# Altium schematic sheet H-00488 - Connectors Upstream.SchDoc: Connectors Upstream
size 403 x 281 mm; DocumentNumber: 11; SheetNumber: 11; SheetTotal: 12
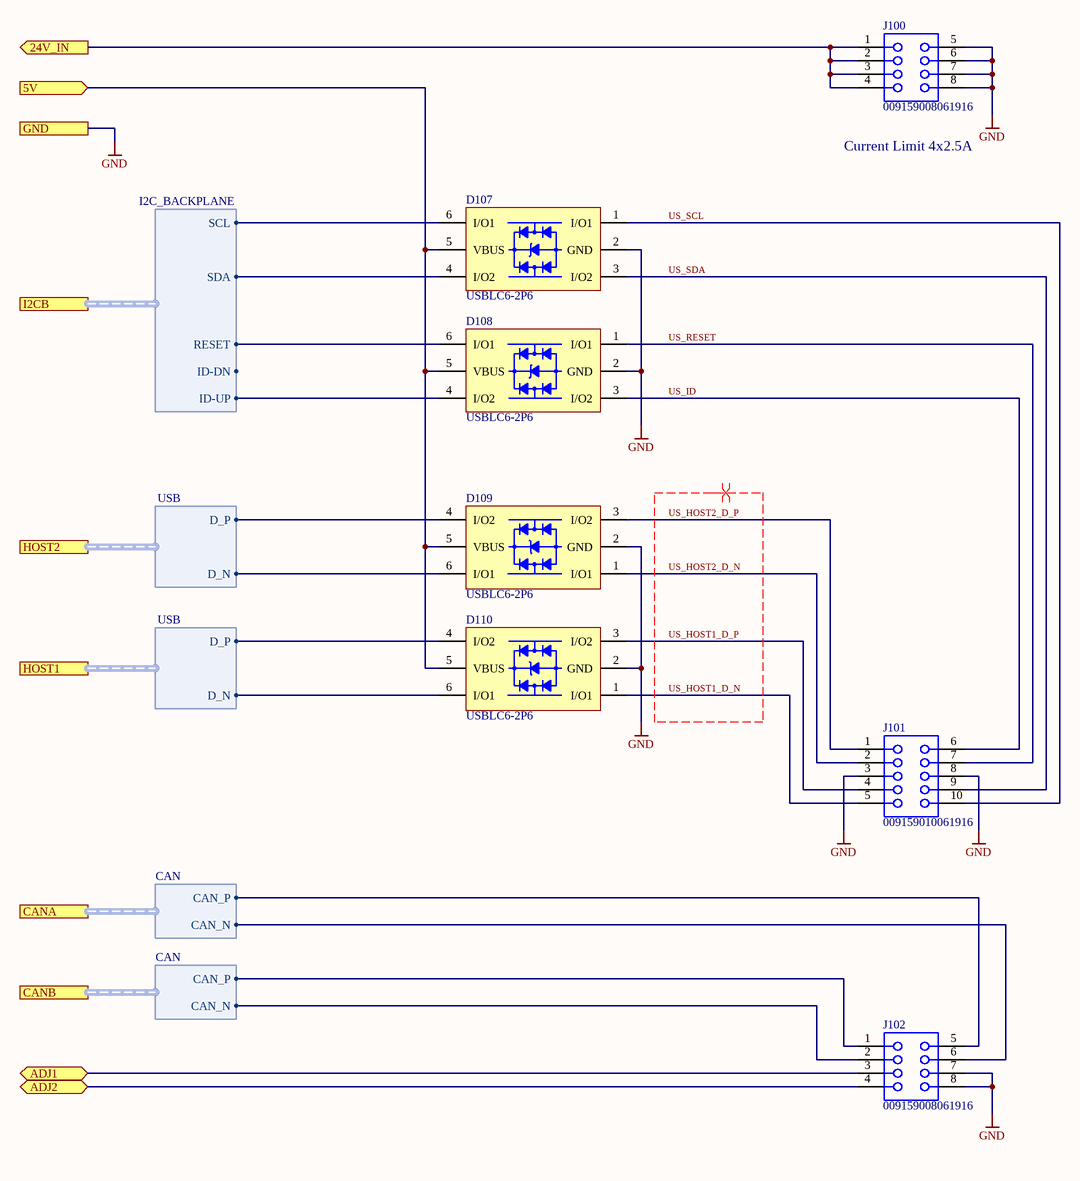
[diagram p0: H-00488 - Connectors Upstream.SchDoc]

## Parts
D107  USBLC6-2P6  [DIOSOFL6P50_160X160X95L29X26]
D108  USBLC6-2P6  [DIOSOFL6P50_160X160X95L29X26]
D109  USBLC6-2P6  [DIOSOFL6P50_160X160X95L29X26]
D110  USBLC6-2P6  [DIOSOFL6P50_160X160X95L29X26]
J100  009159008061916  [AVX_00-9159-008]
J101  009159010061916  [AVX_00-9159-010]
J102  009159008061916  [AVX_00-9159-008]

## Ports
5V (in), 24V_IN (out), ADJ1 (bidir), ADJ2 (bidir), CANA (harness CAN), CANB (harness CAN), GND, HOST1 (harness USB), HOST2 (harness USB), I2CB (harness I2C_BACKPLANE)

## Harnesses
I2C_BACKPLANE: SDA, SCL, ID-UP, RESET, ID-DN
USB: D_P, D_N
CAN: CAN_N, CAN_P

## Nets
GND: D107.2(GND) D108.2(GND) D109.2(GND) D110.2(GND) J100.5 J100.6 J100.7 J100.8 J101.3 J101.8 J102.7 J102.8 ; port GND
5V: D107.5(VBUS) D108.5(VBUS) D109.5(VBUS) D110.5(VBUS) ; port 5V
24V_IN: J100.1 J100.2 J100.3 J100.4 ; port 24V_IN
ADJ1: J102.3 ; port ADJ1
ADJ2: J102.4 ; port ADJ2
US_HOST1_D_N: D110.1(I/O1) J101.5
US_HOST1_D_P: D110.3(I/O2) J101.4
US_HOST2_D_N: D109.1(I/O1) J101.2
US_HOST2_D_P: D109.3(I/O2) J101.1
US_ID: D108.3(I/O2) J101.6
US_RESET: D108.1(I/O1) J101.7
US_SCL: D107.1(I/O1) J101.10
US_SDA: D107.3(I/O2) J101.9
NetD107_4: D107.4(I/O2) ; port I2CB.SDA
NetD107_6: D107.6(I/O1) ; port I2CB.SCL
NetD108_4: D108.4(I/O2) ; port I2CB.ID-UP
NetD108_6: D108.6(I/O1) ; port I2CB.RESET
NetD109_4: D109.4(I/O2) ; port HOST2.D_P
NetD109_6: D109.6(I/O1) ; port HOST2.D_N
NetD110_4: D110.4(I/O2) ; port HOST1.D_P
NetD110_6: D110.6(I/O1) ; port HOST1.D_N
NetJ102_1: J102.1 ; port CANB.CAN_P
NetJ102_2: J102.2 ; port CANB.CAN_N
NetJ102_5: J102.5 ; port CANA.CAN_P
NetJ102_6: J102.6 ; port CANA.CAN_N

## Layout directives
differential pair; differential pair class DIFF_USB_EXT: US_HOST1_D_N, US_HOST1_D_P, US_HOST2_D_N, US_HOST2_D_P

## Notes on the sheet
- (near J100) Current Limit 4x2.5A
- PROJECT
- DESCRIPTION
- SIZE
- ENGINEER
- VARIANT
- A3
- TITLE
- MODIFIED
- RELEASE
- HIBER BV
  MOERMANSKKADE 600
  1013 BC, AMSTERDAM
  THE NETHERLANDS
- FILE NAME
- APPROVER
- SHEET
- APPROVED
- OF
- THIS DOCUMENT AND THE DATA DISCLOSED HEREIN OR HEREWITH IS THE PROPERTY OF HIBER INTERNATIONAL BV. IT CONTAINS CONFIDENTIAL AND PROPRIETARY INFORMATION THAT CANNOT BE REPRODUCED OR DIVULGED, IN WHOLE OR IN PART, WITHOUT WRITTEN AUTHORIZATION.

## Library data of the parts
D107-D110 = CMP-00780-2: TVS DIODE 5.25VWM 17VC SOT666; Reverse Breakdown Voltage: 6V; ESD Protection: Yes; Max Reverse Leakage Current: 150nA; Number of Elements: 1; Clamping Voltage: 17V; Direction: Bidirectional, Unidirectional; Capacitance: 3.5pF; Working Voltage: 5V; Number of Channels: 2; Test Current: 1mA; Peak Pulse Current: 5A; Element Configuration: Dual; Qualification: Standard; Max Operating Temperature: 125°C; Lead Free: Lead Free; Contact Plating: Matte, Tin; Package Quantity: 1; Case/Package: SOT-666; Min Operating Temperature: -40°C; Length: 1.7mm; Breakdown Voltage: 6V; Packaging: Tape and Reel; REACH SVHC: No SVHC; Termination: SMD/SMT; Mount: Surface Mount; Power Line Protection: Yes; Radiation Hardening: No; RoHS: Yes; Leakage Current: 150nA; Polarity: Bidirectional, Unidirectional; Depth: 1.3mm; Number of Bidirectional Channels: 2; Number of Pins: 6; Height: 0.6mm; Reverse Standoff Voltage: 5V; Width: 1.3mm; Min Breakdown Voltage: 6V; Operating Supply Voltage: 5V; Max Breakdown Voltage: 6V
J100 J102 = CMP-01083-5: CONN SSL BRIDGE 8POS 2MM; RoHS: Yes; Mount: TH
J101 = CMP-01075-4: AVX INTERCONNECT - 009159010061916 - CARD EDGE CONN, DUAL SIDE, 10POS, SMD; RoHS: Yes; Mount: TH